# EAGLE design UVBoxSchematic (EAGLE 7.5.0)
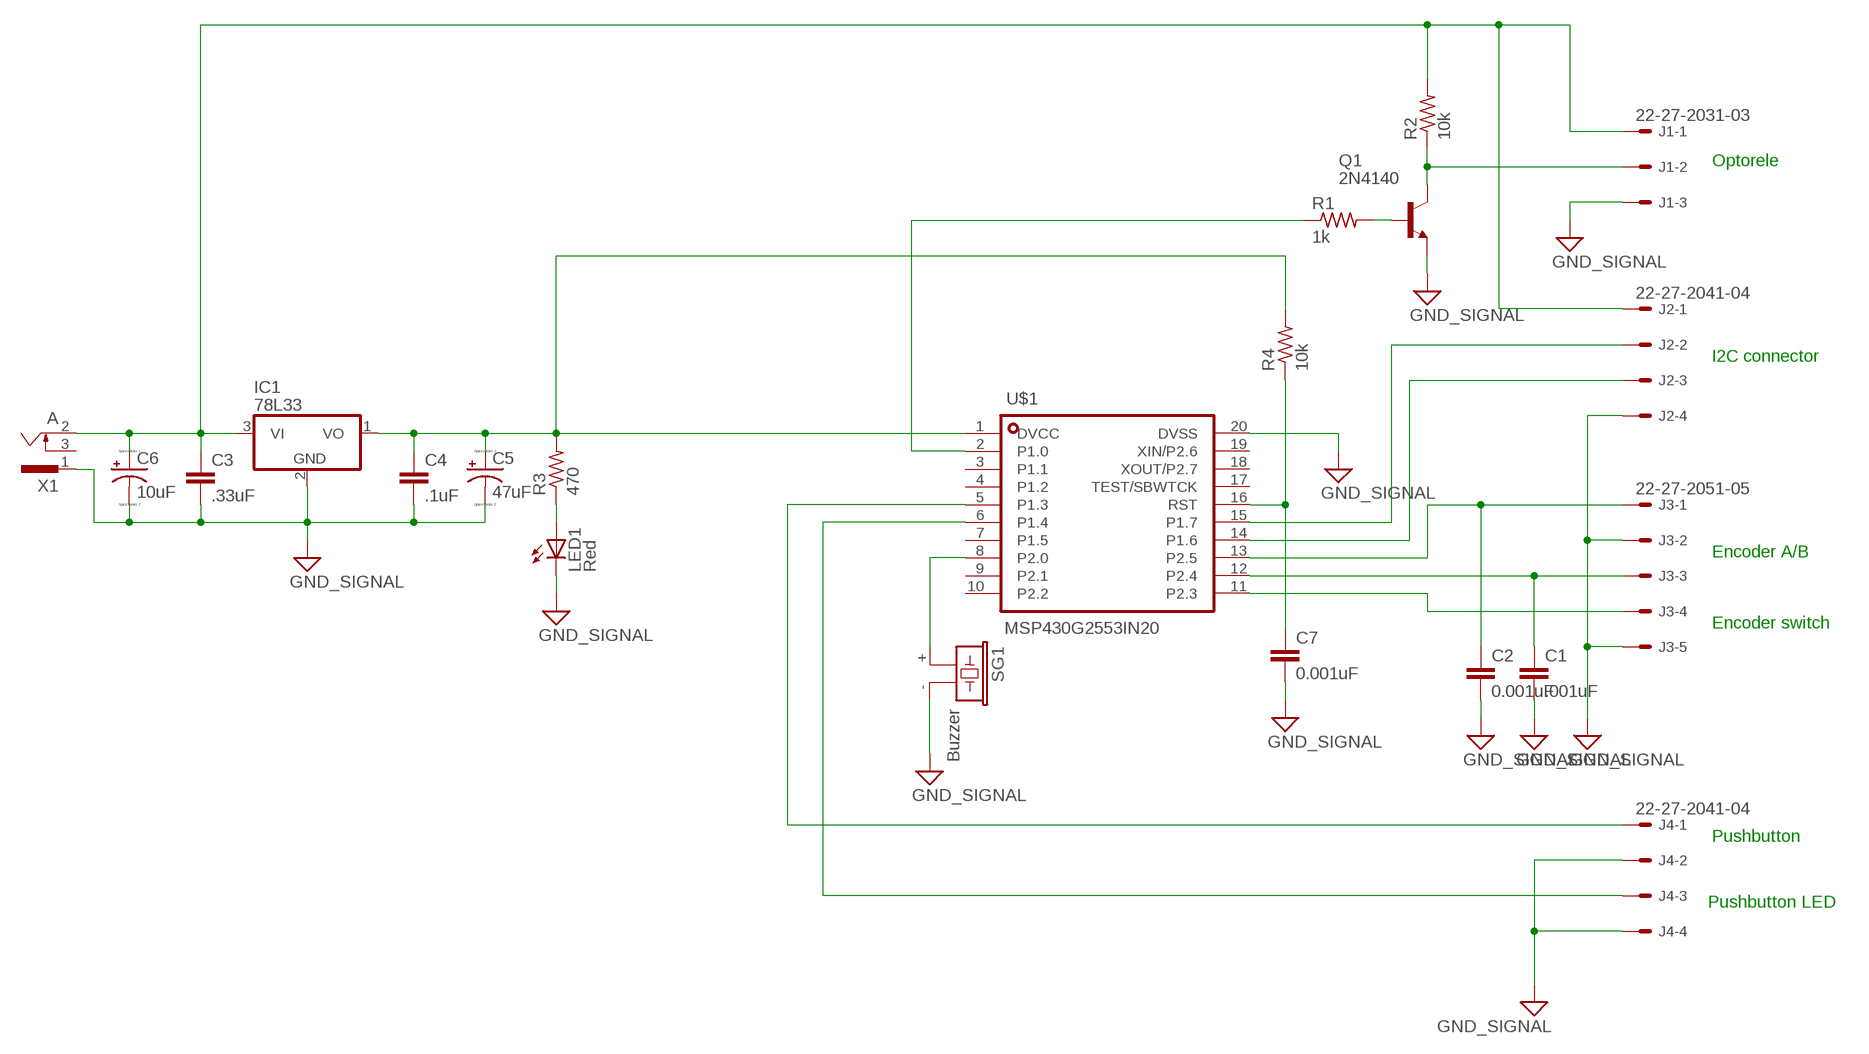
[diagram p0: schematic, sheet 1]

## Parts
C1  .001uF  C5/3  [C5B3]
C2  0.001uF  C5/3  [C5B3]
C3  .33uF  C5/3  [C5B3]
C4  .1uF  C5/3  [C5B3]
C5  47uF  CPOL-USB45181A  [B45181A]
C6  10uF  CPOL-USB45181A  [B45181A]
C7  0.001uF  C5/3  [C5B3]
IC1  78L33  78L05Z  [TO92]
J1  22-27-2031-03  [6410-03]
J2  22-27-2041-04  [6410-04]
J3  22-27-2051-05  [6410-05]
J4  22-27-2041-04  [6410-04]
LED1  Red  LED3MM  [LED3MM]
Q1  2N4140  2N4104  [TO18]
R1  1k  R-US_0204/7  [0204/7]
R2  10k  R-US_0204/7  [0204/7]
R3  470  R-US_0204/7  [0204/7]
R4  10k  R-US_0204/7  [0204/7]
SG1  Buzzer  F/CM04P  [F/CM04P]
U$1  MSP430G2553IN20  [DIP20]
X1  A  SCD-014A  [SCD-014-A]

## Nets
GND: C1.2 C2.2 C3.2 C4.2 C5.- C6.- C7.2 IC1.2(GND) J1.3 J2.4 J3.2 J3.5 J4.2 J4.4 LED1.K(C) Q1.1(E) SG1.- U$1.20(DVSS) X1.1 ; supply symbol labelled GND_SIGNAL
N$1: C3.1 C6.+ IC1.3(VI) J1.1 J2.1 R2.2 X1.2
N$2: C2.1 J3.1 U$1.13(P2.5)
N$3: C1.1 J3.3 U$1.12(P2.4)
N$4: J3.4 U$1.11(P2.3)
N$5: J2.3 U$1.14(P1.6)
N$6: J2.2 U$1.15(P1.7)
N$7: LED1.A R3.1
N$8: C4.1 C5.+ IC1.1(VO) R3.2 R4.2 U$1.1(DVCC)
N$9: J4.1 U$1.5(P1.3)
N$11: J1.2 Q1.3(C) R2.1
N$12: Q1.2(B) R1.2
N$13: R1.1 U$1.2(P1.0)
N$14: J4.3 U$1.6(P1.4)
N$15: SG1.+ U$1.8(P2.0)
N$19: C7.1 R4.1 U$1.16(RST)
Unconnected: U$1.3(P1.1) U$1.4(P1.2) U$1.7(P1.5) U$1.9(P2.1) U$1.10(P2.2) U$1.17(TEST/SBWTCK) U$1.18(XOUT/P2.7) U$1.19(XIN/P2.6) X1.3

## Notes on the sheet
- Optorele
- I2C connector
- Encoder A/B
- Encoder switch
- Pushbutton
- Pushbutton LED

## Library data of the parts
C1 = capacitor-wima:C: CAPACITOR naming: grid - package width; A: 10
C2-C4 C7 = capacitor-wima:C: CAPACITOR naming: grid - package width
C5 C6 = resistor:CPOL-US: POLARIZED CAPACITOR, American symbol
IC1 = linear:78*: Positive VOLTAGE REGULATOR Source: http://cache.national.com/ds/LM/LM78L05.pdf http://www.fairchildsemi.com/ds/LM/LM7805.pdf
J1 = con-molex:22-?-03: CONNECTOR wire to board 2.54 mm (.1 inch) pitch header; OC_FARNELL: unknown; OC_NEWARK: unknown
J2 J4 = con-molex:22-?-04: CONNECTOR wire to board 2.54 mm (.1 inch) pitch header; OC_FARNELL: unknown; OC_NEWARK: unknown
J3 = con-molex:22-?-05: CONNECTOR wire to board 2.54 mm (.1 inch) pitch header; OC_FARNELL: unknown; OC_NEWARK: unknown
LED1 = led:LED: LED OSRAM: - CHIPLED LG R971, LG N971, LY N971, LG Q971, LY Q971, LO R971, LY R971 LH N974, LH R974 LS Q976, LO Q976, LY Q976 LO Q996 - Hyper CHIPLED LW Q18S LB Q993, LB Q99A, LB R99A - SideLED LS A670, LO A670, LY A670, LG A670, LP A670 LB A673, LV A673, LT A673, LW A673 LH A674 LY A675 LS A676, LA A676, LO A676, LY A676, LW A676 LS A679, LY A679, LG A679 - Hyper Micro SIDELED® LS Y876, LA Y876, LO Y876, LY Y876 LT Y87S - SmartLED LW L88C, LW L88S LB L89C, LB L89S, LG L890 LS L89K, LO L89K, LY L89K LS L896, LA L896, LO L896, LY L896 - TOPLED LS T670, LO T670, LY T670, LG T670, LP T670 LSG T670, LSP T670, LSY T670, LOP T670, LYG T670 LG T671, LOG T671, LSG T671 LB T673, LV T673, LT T673, LW T673 LH T674 LS T676, LA T676, LO T676, LY T676, LB T676, LH T676, LSB T676, LW T676 LB T67C, LV T67C, LT T67C, LS T67K, LO T67K, LY T67K, LW E67C LS E67B, LA E67B, LO E67B, LY E67B, LB E67C, LV E67C, LT E67C LW T67C LS T679, LY T679, LG T679 LS T770, LO T770, LY T770, LG T770, LP T770 LB T773, LV T773, LT T773, LW T773 LH T774 LS E675, LA E675, LY E675, LS T675 LS T776, LA T776, LO T776, LY T776, LB T776 LHGB T686 LT T68C, LB T68C - Hyper Mini TOPLED® LB M676 - Mini TOPLED Santana® LG M470 LS M47K, LO M47K, LY M47K Source: http://www.osram.convergy.de LUXEON: - LUMILED® LXK2-PW12-R00, LXK2-PW12-S00, LXK2-PW14-U00, LXK2-PW14-V00 LXK2-PM12-R00, LXK2-PM12-S00, LXK2-PM14-U00 LXK2-PE12-Q00, LXK2-PE12-R00, LXK2-PE12-S00, LXK2-PE14-T00, LXK2-PE14-U00 LXK2-PB12-K00, LXK2-PB12-L00, LXK2-PB12-M00, LXK2-PB14-N00, LXK2-PB14-P00, LXK2-PB14-Q00 LXK2-PR12-L00, LXK2-PR12-M00, LXK2-PR14-Q00, LXK2-PR14-R00 LXK2-PD12-Q00, LXK2-PD12-R00, LXK2-PD12-S00 LXK2-PH12-R00, LXK2-PH12-S00 LXK2-PL12-P00, LXK2-PL12-Q00, LXK2-PL12-R00 Source: www.luxeon.com KINGBRIGHT: KA-3528ASYC Source: www.kingbright.com
Q1 = transistor-npn:2N4104: NPN Transistor
R1-R4 = resistor:R-US_: RESISTOR, American symbol
SG1 = buzzer:F/CM04P: BUZZER Source: Buerklin; OC_FARNELL: unknown; OC_NEWARK: unknown
U$1 = GuShH:MSP430G2553
X1 = con-shiua-chyuan:SCD-014A: Power Jack 2.5mm; OC_FARNELL: unknown; OC_NEWARK: unknown

## Net classes
0 default: clearance 0.205 mm

## Board
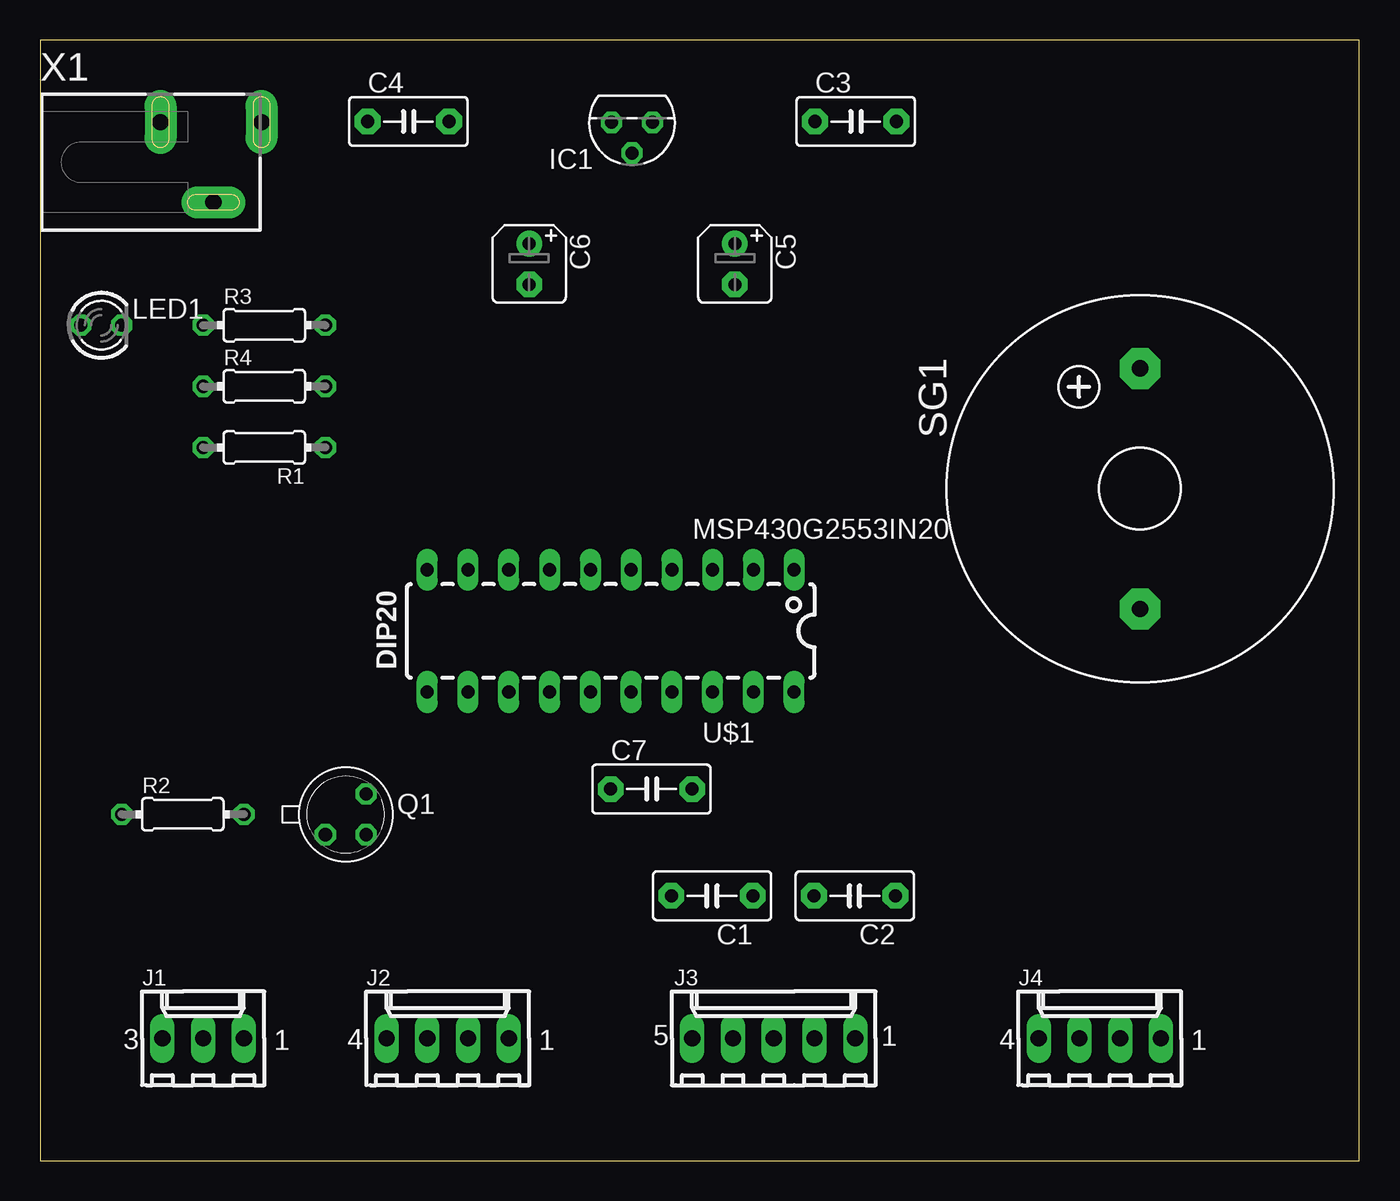
[diagram p1: board, top side]
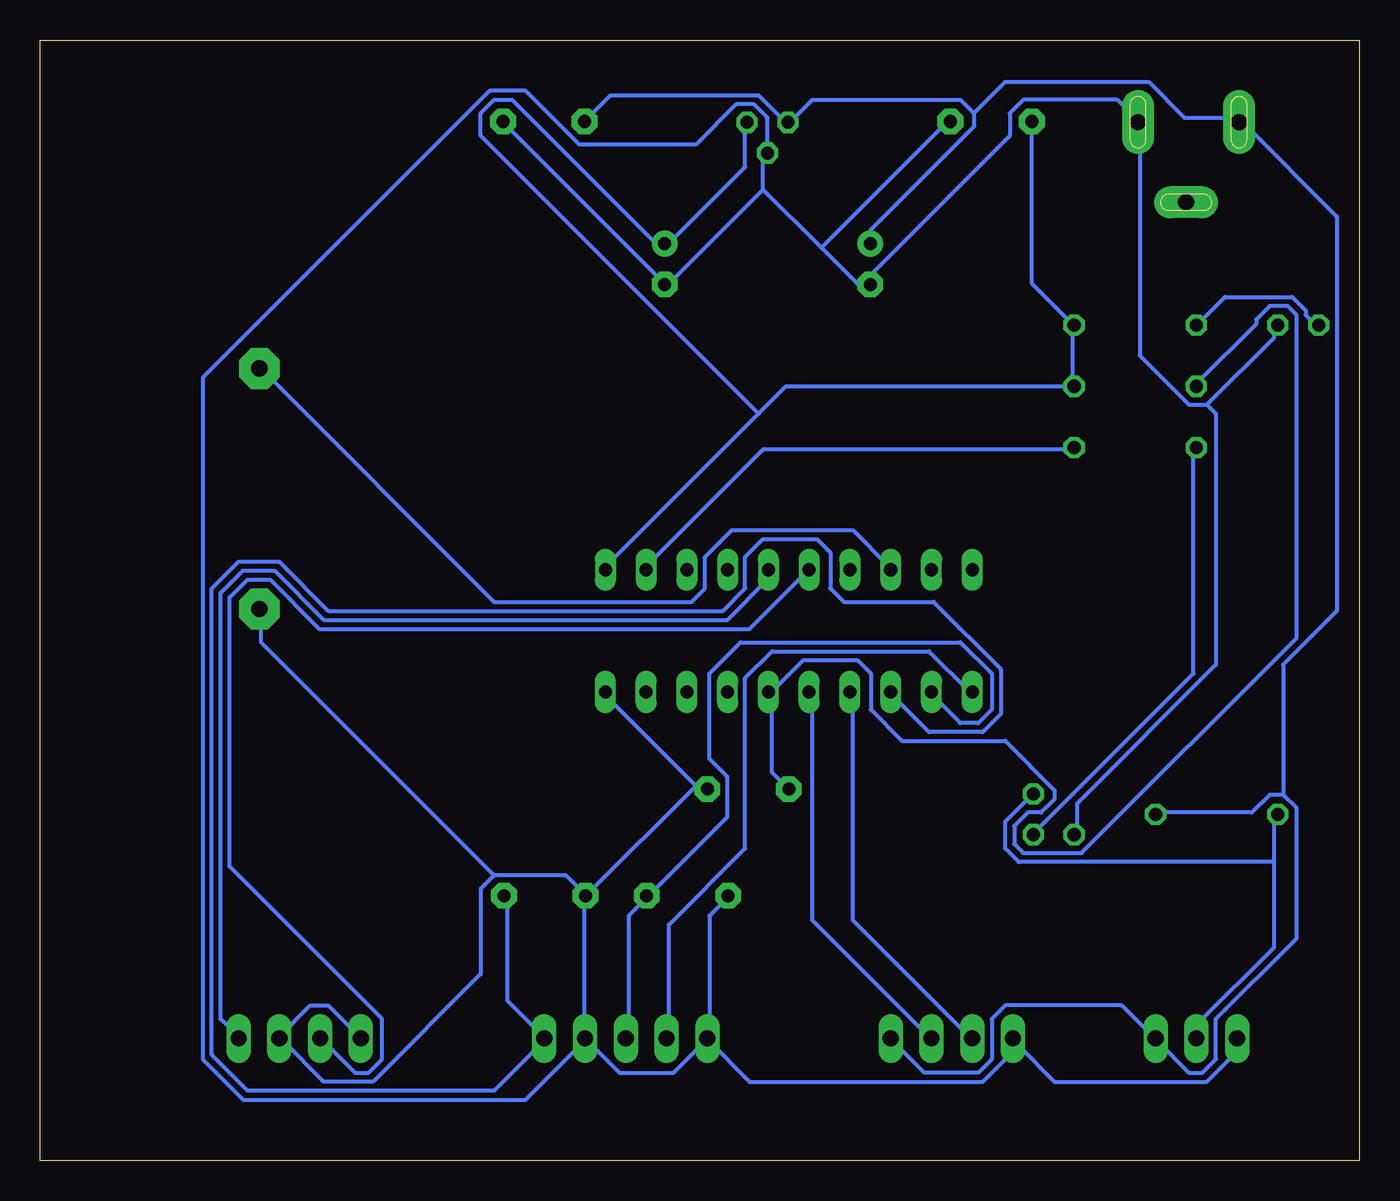
[diagram p2: board, bottom side, seen from below]

Size 82.22 x 69.84 mm. Coordinates in mm from the lower left corner, seen from the top.
Outline: 0,0 82.22,0 82.22,69.84 0,69.84 0,0
Copper layers (1*16): Top 0.035mm / dielectric 2mm / Bottom 0.035mm
Design rules "default *": minimum track width 10mil, minimum drill 24mil, track to track 12mil, track to pad 12mil, pad to pad 12mil, via to via 12mil, smd to smd 8mil, copper to edge 40mil, drill to drill 8mil, minimum pad ring 10mil, minimum via ring 8mil, stop-mask expansion 4mil, vias tented up to drill 0mil, thermal gap 10mil

### Footprints (pad centres in the part's own frame; a part is rotated, then mirrored left to right if it is on the bottom)
C5B3 = drill 0.813 pad 1.6 octagon: 1 -2.54,0; 2 2.54,0
B45181A = drill 0.813 pad 1.6: + -1.27,0 | drill 0.813 pad 1.6 octagon: - 1.27,0
TO92 = drill 0.813 octagon: 1 -1.27,0; 2 0,1.905; 3 1.27,0
6410-03 = drill 1.016 long: 1 2.54,0; 2 0,0; 3 -2.54,0
6410-04 = drill 1.016 long: 1 3.81,0; 2 1.27,0; 3 -1.27,0; 4 -3.81,0
6410-05 = drill 1.016 long: 1 5.08,0; 2 2.54,0; 3 0,0; 4 -2.54,0; 5 -5.08,0
LED3MM = drill 0.813 octagon: A -1.27,0; K 1.27,0
TO18 = drill 0.813 octagon: 1 -1.27,-1.27; 2 1.27,-1.27; 3 1.27,1.27
0204/7 = drill 0.813 octagon: 1 -3.81,0; 2 3.81,0
F/CM04P = drill 1.016 pad 2.54 octagon: + 7.493,0; - -7.493,0
DIP20 = drill 0.813 pad 1.27 long: 1 -11.43,-3.81 | drill 0.813 long: 2 -8.89,-3.81; 3 -6.35,-3.81; 4 -3.81,-3.81; 5 -1.27,-3.81; 6 1.27,-3.81; 7 3.81,-3.81; 8 6.35,-3.81; 9 8.89,-3.81; 10 11.43,-3.81; 11 11.43,3.81; 12 8.89,3.81; 13 6.35,3.81; 14 3.81,3.81; 15 1.27,3.81; 16 -1.27,3.81; 17 -3.81,3.81; 18 -6.35,3.81; 19 -8.89,3.81; 20 -11.43,3.81
SCD-014-A = drill 1 pad 2 long: 1 -2.5,13.8; 2 -2.5,7.5; 3 2.5,10.8

### Placement (x,y rotation side)
C1  41.88,16.51 180 top
C2  50.77,16.51 180 top
C3  50.83,64.77 0 top
C4  22.95,64.77 0 top
C5  43.3,55.88 270 top
C6  30.48,55.88 270 top
C7  38.1,23.16 0 top
IC1  36.89,64.71 180 top
J1  10.16,7.62 0 top
J2  25.4,7.62 0 top
J3  45.72,7.62 0 top
J4  66.04,7.62 0 top
LED1  3.81,52.07 0 top
Q1  19.05,21.59 0 top
R1  13.97,44.45 180 top
R2  8.89,21.59 0 top
R3  13.97,52.07 0 top
R4  13.97,48.26 0 top
SG1  68.55,41.88 90 top
U$1  35.56,33.02 180 top
X1  0,62.23 270 top

### Tracks (layer width: path | path; a pad name or v marks a point on that pad's centre or on a via)
GND
  Bottom 0.254: 21.23,7.16 21.51,7.44 J2.4 21.23,7.16 | 21.23,7.16 19,4.93 9.5,4.93 7.82,6.6 7.82,7.44 J1.3 | 41.35,23.37 46.94,28.96 U$1.20 | 41.35,23.37 40.79,23.37 C7.2 41.35,23.37 | J3.5 40.51,7.72 40.51,15.27 39.4,16.38 C1.2 | J4.4 62.31,7.72 64.26,9.68 65.38,9.68 67.33,7.72 J4.2 67.06,7.44 64.54,4.93 61.47,4.93 54.76,11.63 54.76,16.94 53.92,17.78 | J3.2 48.34,7.72 48.34,16.38 C2.2 | 53.92,17.78 49.45,17.78 48.34,16.66 C2.2 | 53.92,17.78 68.45,32.31 68.45,34.27 SG1.- | J3.5 40.79,7.44 42.75,5.49 46.1,5.49 48.06,7.44 J3.2 | 41.35,23.37 48.06,16.66 C2.2 | 21.23,7.16 23.47,4.93 38,4.93 40.51,7.44 J3.5 | 37.16,60.53 37.16,62.76 IC1.2 36.88,63.04 36.88,65 37.72,65.84 38.84,65.84 41.35,63.32 48.62,63.32 51.97,66.67 54.2,66.67 72.08,48.79 72.08,6.32 69.57,3.81 51.97,3.81 48.34,7.44 J3.2 | 37.16,60.53 43.03,54.66 C5.- 43.31,54.66 53.37,64.72 C3.2 | 37.16,60.53 33.53,56.9 | 33.53,56.9 31.29,54.66 30.73,54.66 C6.- 30.45,54.66 30.45,55.22 21.79,63.88 21.79,65.28 20.95,66.12 15.09,66.12 13.97,65 X1.1 13.69,64.72 13.69,50.19 10.62,47.12 9.5,47.12 | 33.53,56.9 25.7,64.72 C4.2 | 9.5,47.12 5.31,51.31 5.31,51.87 LED1.K | 9.5,47.12 8.94,46.56 8.94,30.91 17.6,22.25 17.6,20.57 Q1.1
N$1
  Bottom 0.254: 4.75,22.81 5.59,22.81 6.71,21.69 12.57,21.69 R2.2 | 4.75,22.81 3.91,21.97 3.91,13.87 8.94,8.84 8.94,6.32 9.78,5.49 10.62,5.49 12.57,7.44 J1.1 12.85,7.72 14.81,9.68 22.07,9.68 22.91,8.84 22.91,6.32 23.75,5.49 27.1,5.49 29.06,7.44 J2.1 | C3.1 48.06,65 46.66,66.4 37.44,66.4 35.76,64.72 IC1.3 35.48,64.72 34.09,66.12 24.87,66.12 24.03,65.28 | 24.03,65.28 24.03,64.44 30.45,58.01 30.45,57.17 C6.+ | 24.03,65.28 22.07,67.23 13.13,67.23 10.9,65 7.54,65 X1.2 7.26,64.72 1.4,58.85 1.4,34.27 4.75,30.91 4.75,22.81
N$2
  Bottom 0.254: U$1.13 29.06,28.96 26.82,26.72 23.47,26.72 22.35,27.84 22.35,30.63 26.54,34.82 32.13,34.82 32.97,35.66 32.97,37.9 33.81,38.73 37.16,38.73 38.28,37.62 38.28,35.66 39.67,34.27 64.26,34.27 67.33,37.34 69.85,37.34 71.53,35.66 71.53,6.6 69.29,4.37 53.92,4.37 50.85,7.44 J3.1 50.85,7.72 53.09,9.96 53.09,16.38 C2.1
N$3
  Bottom 0.254: U$1.12 26.54,28.96 24.87,27.28 23.75,27.28 22.91,28.12 22.91,30.35 24.87,32.31 38.56,32.31 40.51,30.35 40.51,25.04 39.4,23.93 39.4,21.41 44.15,16.66 C1.1 44.42,16.38 45.54,15.27 45.54,7.72 J3.3
N$4
  Bottom 0.254: U$1.11 24.31,29.24 26.82,31.75 36.6,31.75 38.28,30.07 38.28,19.46 43.03,14.71 43.03,7.72 J3.4
N$5
  Bottom 0.254: U$1.14 31.57,28.96 31.57,14.99 24.31,7.72 J2.3
N$6
  Bottom 0.254: U$1.15 34.09,28.96 34.09,14.99 26.82,7.72 J2.2
N$7
  Bottom 0.254: LED1.A 2.79,52.15 3.35,52.7 3.35,52.98 4.19,53.82 8.38,53.82 10.06,52.15 R3.1
N$8
  Bottom 0.254: IC1.1 38.28,64.44 38.28,61.92 43.03,57.17 C5.+ 43.31,57.17 43.87,57.17 52.81,66.12 53.92,66.12 54.76,65.28 54.76,63.88 37.44,46.56 | 37.44,46.56 35.76,48.23 17.88,48.23 R4.2 17.88,48.51 17.88,51.87 R3.2 17.88,52.15 20.4,54.66 20.4,64.72 C4.1 | 37.44,46.56 46.94,37.06 U$1.1
N$9
  Bottom 0.254: U$1.5 36.88,36.78 36.88,36.22 39.4,33.71 64.54,33.71 67.61,36.78 69.57,36.78 70.97,35.38 70.97,8.84 69.85,7.72 J4.1
N$11
  Bottom 0.254: 5.31,18.62 5.31,13.31 10.06,8.56 10.06,7.72 J1.2 | 5.31,18.62 5.31,21.41 R2.1 | 5.31,18.62 21.23,18.62 22.07,19.46 22.07,21.13 20.4,22.81 Q1.3
N$12
  Bottom 0.254: R1.2 10.34,44.32 10.34,30.35 20.12,20.57 Q1.2
N$13
  Bottom 0.254: U$1.2 44.42,37.06 37.16,44.32 17.88,44.32 R1.1
N$14
  Bottom 0.254: U$1.6 34.37,36.78 38,33.15 64.82,33.15 67.89,36.22 69.29,36.22 70.41,35.1 70.41,18.34 60.91,8.84 60.91,6.32 61.75,5.49 62.59,5.49 64.54,7.44 J4.3
N$15
  Bottom 0.254: U$1.8 29.34,37.06 31.57,39.29 39.12,39.29 40.79,37.62 40.79,35.66 41.63,34.82 53.92,34.82 68.45,49.35 SG1.+
N$19
  Bottom 0.254: C7.1 35.76,23.37 36.6,24.21 36.6,28.96 U$1.16 36.6,29.24 34.65,31.19 31.29,31.19 30.45,30.35 30.45,28.12 28.5,26.16 22.07,26.16 19,23.09 19,22.53 19.84,21.69 20.68,21.69 21.51,20.85 21.51,19.74 20.95,19.18 17.32,19.18 3.91,32.59 3.91,52.7 4.47,53.26 5.59,53.26 6.43,52.43 6.43,52.15 10.06,48.51 R4.1